# EAGLE design MicroMod-LoRa-1W-Function-Board (EAGLE 9.5.2)
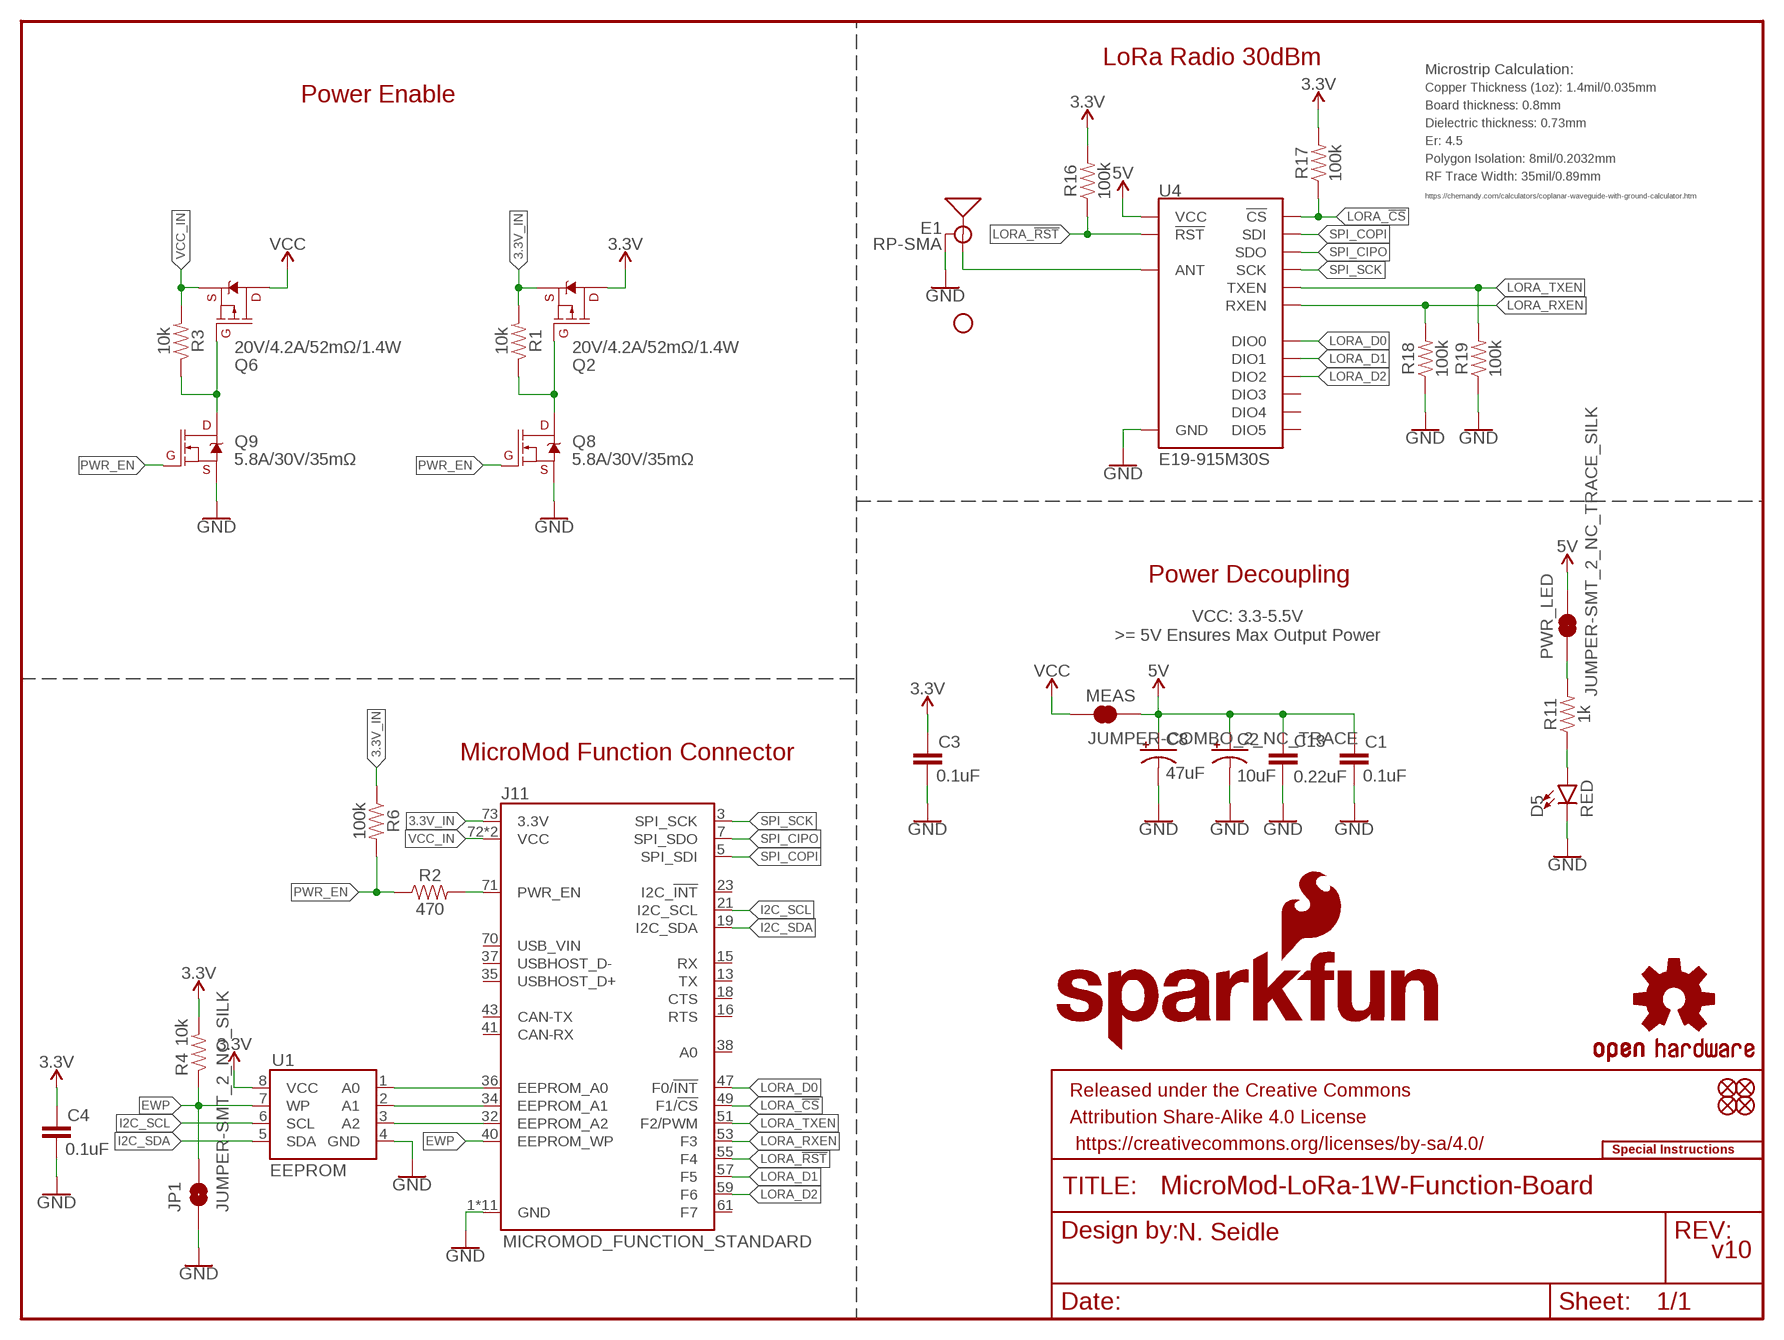
[diagram p0: schematic, sheet 1]

## Parts
C1  0.1uF  0.1UF-0603-25V-(+80/-20%)  [0603]
C2  10uF  10UF-POLAR-EIA3216-16V-10%(TANT)  [EIA3216]
C3  0.1uF  0.1UF-0603-25V-(+80/-20%)  [0603]
C4  0.1uF  0.1UF-0603-25V-(+80/-20%)  [0603]
C8  47uF  47UF-POLAR-EIA3528-10V-10%  [EIA3528]
C13  0.22uF  0.22UF-0603-25V-10%  [0603]
D5  RED  LED-RED0603  [LED-0603]
E1  RP-SMA  ANTENNA-SMA-GROUNDEDEDGE_RPSMA_SMD  [SMA-EDGE-SMD]
FD1  FIDUCIALUFIDUCIAL  [FIDUCIAL-MICRO]
FD2  FIDUCIALUFIDUCIAL  [FIDUCIAL-MICRO]
FD3  FIDUCIALUFIDUCIAL  [FIDUCIAL-MICRO]
FD4  FIDUCIALUFIDUCIAL  [FIDUCIAL-MICRO]
FRAME2  FRAME-LETTER  [CREATIVE_COMMONS]
H1  STAND-OFF  [STAND-OFF]
J11  MICROMOD_FUNCTION_STANDARD  [M.2-CARD-E-22_FUNCTION_STANDARD]
JP1  JUMPER-SMT_2_NO_SILK  [SMT-JUMPER_2_NO_SILK]
LOGO1  SFE_LOGO_NAME_FLAME.1_INCH  [SFE_LOGO_NAME_FLAME_.1]
LOGO2  SPECIAL_INSTRUCTIONS-ORDERING  [ORDERING_INSTRUCTIONS]
LOGO3  OSHW-LOGOMINI  [OSHW-LOGO-MINI]
MEAS  JUMPER-COMBO_2_NC_TRACE  [COMBO-JUMPER_2_NC_TRACE]
PWR_LED  JUMPER-SMT_2_NC_TRACE_SILK  [SMT-JUMPER_2_NC_TRACE_SILK]
Q2  20V/4.2A/52mΩ/1.4W  MOSFET_PCH-DMG2305UX-7  [SOT23-3]
Q6  20V/4.2A/52mΩ/1.4W  MOSFET_PCH-DMG2305UX-7  [SOT23-3]
Q8  5.8A/30V/35mΩ  MOSFET-NCH-AO3404A  [SOT23-3]
Q9  5.8A/30V/35mΩ  MOSFET-NCH-AO3404A  [SOT23-3]
R1  10k  10KOHM-0603-1/10W-1%  [0603]
R2  470  470OHM-0603-1/10W-1%  [0603]
R3  10k  10KOHM-0603-1/10W-1%  [0603]
R4  10k  10KOHM-0603-1/10W-1%  [0603]
R6  100k  100KOHM-0603-1/10W-1%  [0603]
R11  1k  1KOHM-0603-1/10W-1%  [0603]
R16  100k  100KOHM-0603-1/10W-1%  [0603]
R17  100k  100KOHM-0603-1/10W-1%  [0603]
R18  100k  100KOHM-0603-1/10W-1%  [0603]
R19  100k  100KOHM-0603-1/10W-1%  [0603]
U1  EEPROM  EEPROM-I2C512K  [SO08]
U4  E19-915M30S  E19-915MS1W  [E19-915MS1W]

## Nets
3.3V: C3.1 C4.1 Q2.3(D) R4.2 R16.2 R17.2 U1.8(VCC)
3.3V_IN: J11.73(3.3V) Q2.2(S) R1.2 R6.1
5V: C1.1 C2.+ C8.A(+) C13.1 MEAS.2 MEAS.4 PWR_LED.2 U4.11(VCC)
A0: J11.36(EEPROM_A0) U1.1(A0)
A1: J11.34(EEPROM_A1) U1.2(A1)
A2: J11.32(EEPROM_A2) U1.3(A2)
EWP: J11.40(EEPROM_WP) JP1.2 R4.1 U1.7(WP)
GND: C1.2 C2.- C3.2 C4.2 C8.C(-) C13.2 D5.C E1.GND@0(GND) E1.GND@1(GND) J11.1(GND) J11.33(GND) J11.39(GND) J11.45(GND) J11.75(GND) J11.GND1(GND) J11.GND2(GND) J11.GND3(GND) J11.GND4(GND) J11.GND5(GND) J11.GND6(GND) JP1.1 Q8.2(S) Q9.2(S) R18.1 R19.1 U1.4(GND) U4.1(GND) U4.9(GND) U4.10(GND) U4.18(GND) U4.20(GND) U4.21(GND) U4.22(GND)
I2C_SCL: J11.21(I2C_SCL) U1.6(SCL)
I2C_SDA: J11.19(I2C_SDA) U1.5(SDA)
LORA_!CS!: J11.49(F1/!CS!) R17.1 U4.15(!CS)
LORA_!RST!: J11.55(F4) R16.1 U4.8(!RST)
LORA_D0: J11.47(F0/!INT!) U4.7(DIO0)
LORA_D1: J11.57(F5) U4.6(DIO1)
LORA_D2: J11.59(F6) U4.5(DIO2)
LORA_RXEN: J11.53(F3) R18.2 U4.17(RXEN)
LORA_TXEN: J11.51(F2/PWM) R19.2 U4.16(TXEN)
N$1: E1.SIG(SIGNAL) U4.19(ANT)
N$2: Q2.1(G) Q8.3(D) R1.1
N$3: Q6.1(G) Q9.3(D) R3.1
N$4: J11.71(PWR_EN) R2.2
N$5: D5.A R11.1
N$6: PWR_LED.1 R11.2
PWR_EN: Q8.1(G) Q9.1(G) R2.1 R6.2
SPI_CIPO: J11.7(SPI_SDO) U4.13(SDO)
SPI_COPI: J11.5(SPI_SDI) U4.14(SDI)
SPI_SCK: J11.3(SPI_SCK) U4.12(SCK)
VCC: MEAS.1 MEAS.3 Q6.3(D)
VCC_IN: J11.72(VCC) J11.74(VCC) Q6.2(S) R3.2
Unconnected: J11.13(TX) J11.15(RX) J11.16(RTS) J11.18(CTS) J11.23(I2C_!INT!) J11.35(USBHOST_D+) J11.37(USBHOST_D-) J11.38(A0) J11.41(CAN-RX) J11.43(CAN-TX) J11.61(F7) J11.70(USB_VIN) U4.2(DIO5) U4.3(DIO4) U4.4(DIO3)

## Notes on the sheet
- LoRa Radio 30dBm
- Microstrip Calculation:
- Power Enable | Copper Thickness (1oz): 1.4mil/0.035mm
- Board thickness: 0.8mm
- Dielectric thickness: 0.73mm
- Er: 4.5
- Polygon Isolation: 8mil/0.2032mm
- RF Trace Width: 35mil/0.89mm
- https://chemandy.com/calculators/coplanar-waveguide-with-ground-calculator.htm
- Power Decoupling
- VCC: 3.3-5.5V
  >= 5V Ensures Max Output Power
- MicroMod Function Connector
- N. Seidle
- v10

## Library data of the parts
C1 C3 C4 = SparkFun-Capacitors:0.1UF: 0.1µF ceramic capacitors A capacitor is a passive two-terminal electrical component used to store electrical energy temporarily in an electric field.; PROD_ID: CAP-00810
C2 = SparkFun-Capacitors:10UF-POLAR: 10.0µF polarized capacitors A capacitor is a passive two-terminal electrical component used to store electrical energy temporarily in an electric field.; PROD_ID: CAP-00811
C8 = SparkFun-Capacitors:47UF-POLAR: 47µF polarized capacitors A capacitor is a passive two-terminal electrical component used to store electrical energy temporarily in an electric field.; PROD_ID: CAP-08310
C13 = SparkFun-Capacitors:0.22UF: 0.22µF ceramic capacitors A capacitor is a passive two-terminal electrical component used to store electrical energy temporarily in an electric field.; PROD_ID: CAP-07822
D5 = SparkFun-LED:LED-RED: Red SMD LED Used in manufacturing of most products at SparkFun Packages: 0603 - SMD 0603 package [Product Link] <http://docs.avagotech.com/docs/AV02-0551EN> 0603 SMART - SMD 0603 SMART package ( more efficient and expensive)[Product Link] <http://www.osram-os.com/Graphics/XPic2/00077099_0.pdf> 1206 - SMD1206 package [Product Link] <https://www.sparkfun.com/datasheets/DevTools/LilyPad/Q150OVS4.pdff> SparkFun Products: Pro Mini 328 -5V <https://www.sparkfun.com/products/821> RedBoard <https://www.sparkfun.com/products/12757> IOIO-OTG <https://www.sparkfun.com/products/13613>; PROD_ID: DIO-00819
E1 = SparkFun-RF:ANTENNA-SMA-GROUNDED: SMA Antenna Connector w/ Ground Edge-mount and SMD SMA connectors for RF Antennas. **4-LAYER BOARD WARNING!!** When designing a 4-layer board using any of the SMD variants, you will need to manually add a cutout polygon on any internal power layers to make sure that you don't end up with exposed copper around the edge of the routed hole for these connectors. Exposed power copper could then short to the connector body - and that would be bad. Why hasn't anyone added the cutout polygons directly to the connector footprint? Well, your internal layers (usually 2 and 15) may be covered with GND polygons and you might well want the copper to go all the way to the edge, especially under the connector SIGNAL pin. So adding cutouts to the footprint might make matters worse, not better...; PROD_ID: CONN-15101
FD1-FD4 = SparkFun-Aesthetics:FIDUCIAL: Fiducial Alignment Points Point-of-reference for pick-and-place machines and other optical instruments.
FRAME2 = SparkFun-Aesthetics:FRAME-LETTER: Schematic Frame - Letter Standard 8.5x11 US Letter frame
H1 = SparkFun-Hardware:STAND-OFF: Stand Off Drill holes for mechanically mounting via screws, standoffs, etc. Note: Use the keepout ring to avoid running the screw head into surrounding components. Variant Overviews STAND-OFF - Mechanical footprint for a #4 phillips button head screw. STAND-OFF-TIGHT - Mechanical footprint for a #4 phillips button head screw, Example SparkFun Products Screw - Phillips Head (1/4", 4-40, 10 pack) <https://www.sparkfun.com/products/10453> (PRT-10453) Screw - Phillips Head (1/2", 4-40, 10 pack) <https://www.sparkfun.com/products/10452> (PRT-10452) Screw - Phillips Head (3/4", 4-40, 10 pack) <https://www.sparkfun.com/products/10451> (PRT-10451) Screw - Phillips Head (1", 4-40, 10 pack) <https://www.sparkfun.com/products/10450> (PRT-10450)
J11 = SparkFun-MicroMod:MICROMOD_FUNCTION: MicroMod Connector Description: A card edge connector and mating PCB connector to allow various MicroMod Processor Boards to be coupled with various carrier boards of different capabilities. Based on the M.2 standard.
JP1 = SparkFun-Jumpers:JUMPER-SMT_2_NO: Normally open jumper This jumper has two pads in close proximity to each other. Apply solder to close the connection. Round pads are easier to solder for beginners, but are a lot larger. SparkFun Product that uses the round pads: SparkFun EL Sequencer <https://www.sparkfun.com/products/12781>
LOGO1 = SparkFun-Aesthetics:SFE_LOGO_NAME_FLAME: SparkFun Font Logo w/ Flame This is the SparkFun full logo. The logo on the schematic will always be the same size; the package variant is the height of the flame part of the logo. Default layer for the logo on the board is tSilk.
LOGO2 = SparkFun-Aesthetics:SPECIAL_INSTRUCTIONS: Special Ordering/Production Instructions Alert Symbol for special PCB ordering instructions or unique production process warnings. Ordering Instructions Production Instructions Types of information that should be added to box: Copper weight Soldermask color Silk color PCB thickness Number of layers PCB Standard: 1.6mm FR4 1 oz copper immersion silver plating red soldermask white silkscreen Types of information that should be added to box: Special wash requirements Depaneling instructions Humidification Glue curing Default text settings: 0.07 inch 9% ratio 50% line distance
LOGO3 = SparkFun-Aesthetics:OSHW-LOGO: Open-Source Hardware (OSHW) Logo This logo indicates the piece of hardware it is found on incorporates a OSHW license and/or adheres to the definition of open source hardware found here: http://freedomdefined.org/OSHW
MEAS = SparkFun-Jumpers:JUMPER-COMBO_2_NC_TRACE
PWR_LED = SparkFun-Jumpers:JUMPER-SMT_2_NC_TRACE: Normally closed trace jumper This jumper has a trace between two pads so it's normally closed (NC). Use a razor knife to open the connection. For best results follow the IPC guidelines for cutting traces: Cutout at least 0.063 mm (0.005 in). Remove all loose material to clean up the cut area. Seal the cut with an approved epoxy. Reapply solder to reclose the connection.
Q2 Q6 = SparkFun-DiscreteSemi:MOSFET_PCH: P-channel MOSFETs Voltage controlled devices that allow control of high current outputs. SparkFun Products: SparkFun ESP32 Thing <https://www.sparkfun.com/products/13907> SparkFun ESP8266 Thing <https://www.sparkfun.com/products/13231> SparkFun Pi Servo HAT V2 <https://www.sparkfun.com/products/15316> DMG2305UX-7 (20V/4.2A/SOT23-3); PROD_ID: TRANS-14388
Q8 Q9 = SparkFun-DiscreteSemi:MOSFET-NCH: N-channel MOSFETs Voltage controlled devices that allow control of high current outputs. SparkFun Products: SparkFun OpenScale <https://www.sparkfun.com/products/13261> SparkFun Digital Sandbox <https://www.sparkfun.com/products/12651> SparkFun Monster Moto Shield <https://www.sparkfun.com/products/10182> SparkFun MOSFET Power Controller <https://www.sparkfun.com/products/11214>; PROD_ID: TRANS-12988
R1 R3 R4 = SparkFun-Resistors:10KOHM: 10kΩ resistor A resistor is a passive two-terminal electrical component that implements electrical resistance as a circuit element. Resistors act to reduce current flow, and, at the same time, act to lower voltage levels within circuits. - Wikipedia; PROD_ID: RES-00824
R2 = SparkFun-Resistors:470OHM: 470Ω resistor A resistor is a passive two-terminal electrical component that implements electrical resistance as a circuit element. Resistors act to reduce current flow, and, at the same time, act to lower voltage levels within circuits. - Wikipedia; PROD_ID: RES-07869
R6 R16-R19 = SparkFun-Resistors:100KOHM: 100kΩ resistor A resistor is a passive two-terminal electrical component that implements electrical resistance as a circuit element. Resistors act to reduce current flow, and, at the same time, act to lower voltage levels within circuits. - Wikipedia; PROD_ID: RES-07828
R11 = SparkFun-Resistors:1KOHM: 1kΩ resistor A resistor is a passive two-terminal electrical component that implements electrical resistance as a circuit element. Resistors act to reduce current flow, and, at the same time, act to lower voltage levels within circuits. - Wikipedia; PROD_ID: RES-07856
U1 = SparkFun-IC-Memory:EEPROM-I2C: I2C EEPROMs, 24LC256 and others 24LC256 Series 256 kb I2C 2 Wire (32 k x 8 Bit) 2.5 V Serial EEPROM SMD - SOIC-8 Datasheet SparkFun Products SparkFun UDB5 - PIC UAV Development Board <https://www.sparkfun.com/products/11703> (GPS-11703); PROD_ID: IC-14645
U4 = SparkFun-RF:E19-915MS1W: Chengdu Ebyte E19-915M30S - 915M LoRa (FSK) TRX Using SX1276 This is a 915 MHz LoRa (or optionally FSK) modulated transciver bassed on the Semtech SX1276. It has a high ouput power of 1W an a pre-installed U.FL connector. Can be used with LoRa WAN with DIO0, DIO1, and DIO2 hooked up to controller interrupt inputs SparkFun Products: SAMD21 Pro RF 1W <https://www.sparkfun.com/products/15034>; PROD_ID: IC-14076

## Net classes
0 default: width 0 mm, drill 0 mm
1 vcc: width 0 mm

## Board
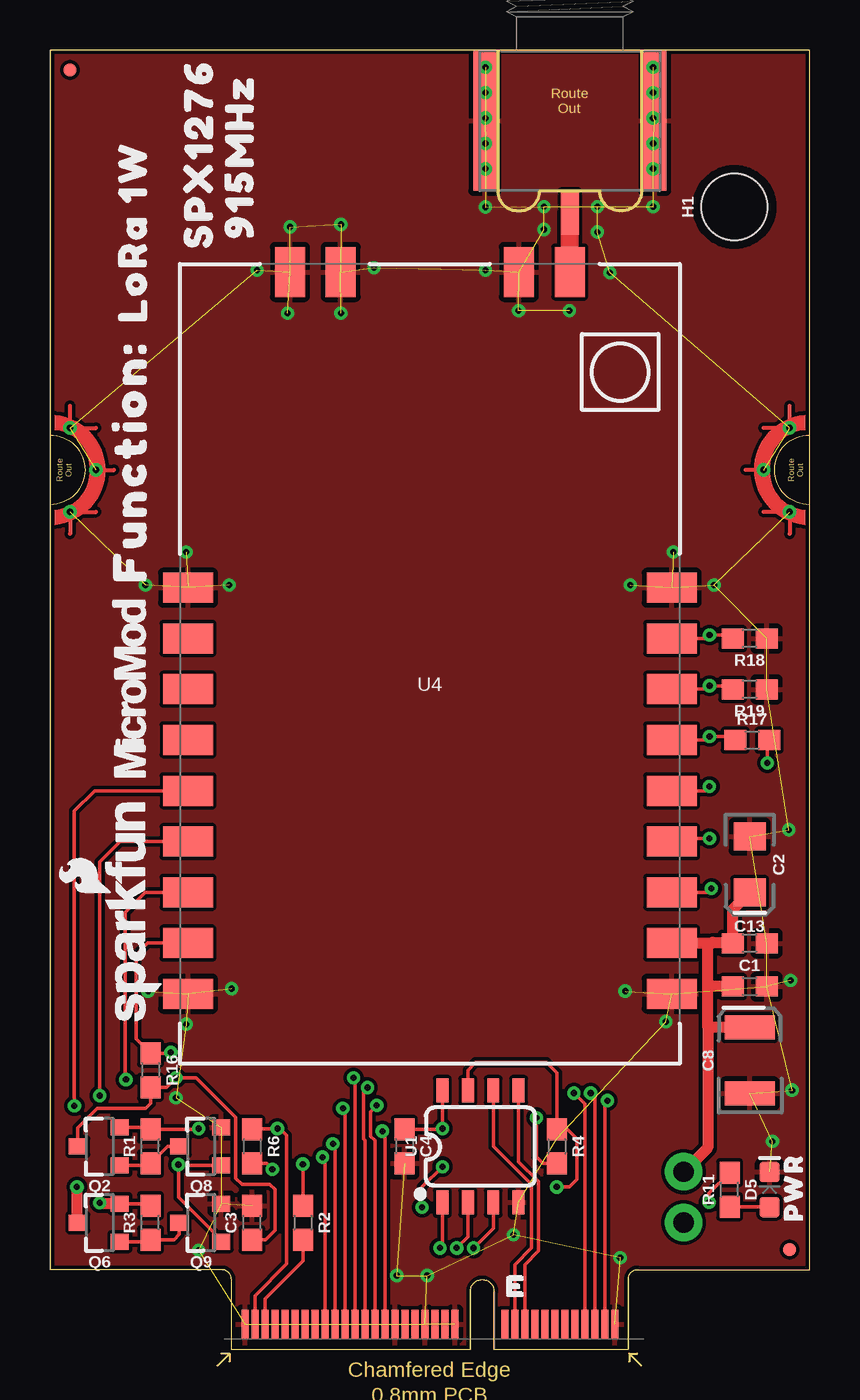
[diagram p1: board, top side]
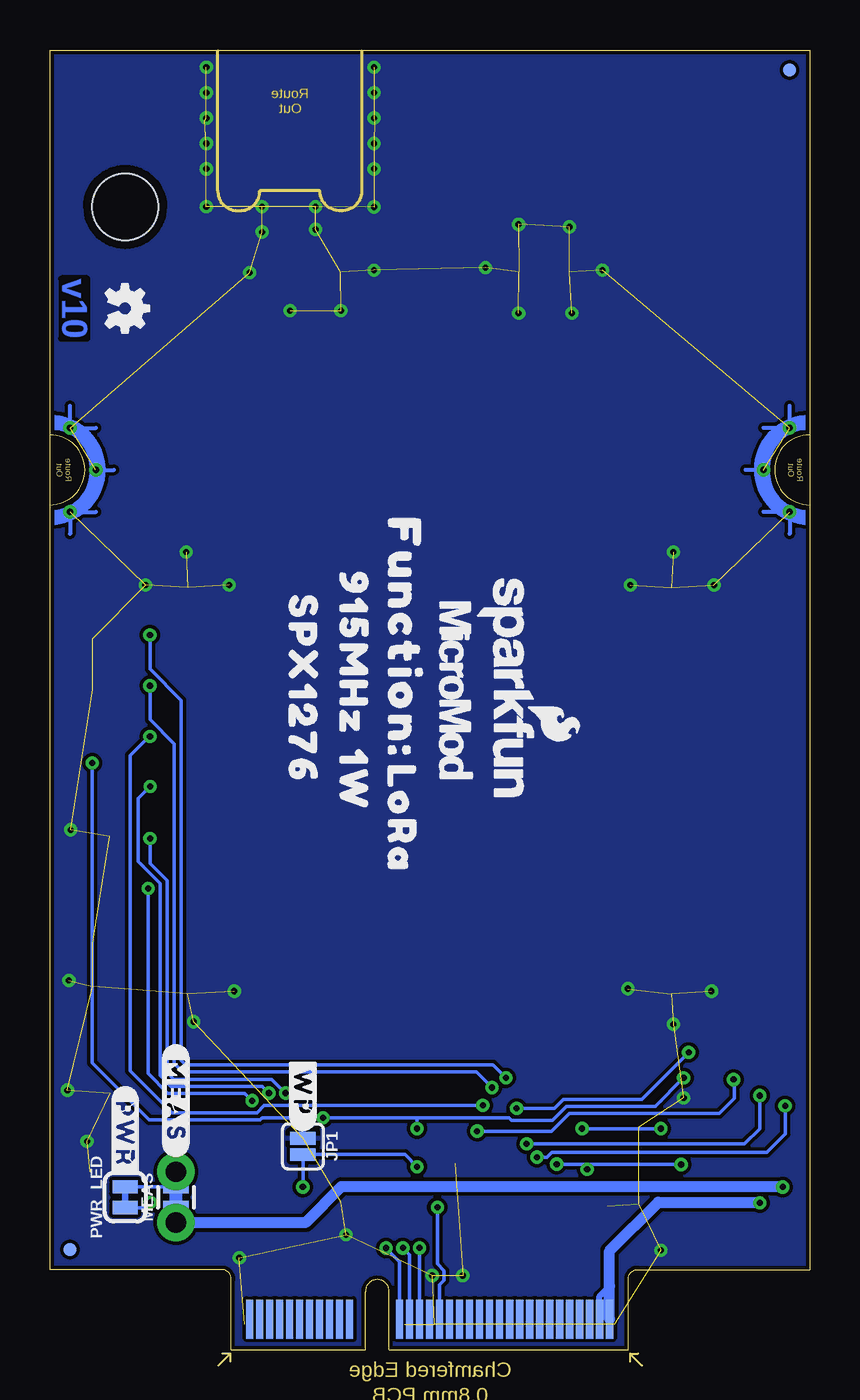
[diagram p2: board, bottom side, seen from below]

Size 38 x 65 mm. Coordinates in mm from the lower left corner, seen from the top.
Outline: 28.93,0 22.22,0 22.22,2.9 arc180 21.02,2.9 21.02,0 9.07,0 9.07,3.5 arc90 8.6,4 0,4 0,65 38,65 38,4 29.4,4 arc90 28.93,3.5 28.93,0
Copper layers (1*16): Top/Horz 0.035mm / dielectric 1.5mm / Bottom/Vert 0.035mm
Design rules "SparkFun-2-layer-TIGHT *": minimum track width 7mil, minimum drill 12mil, track to track 7mil, track to pad 7mil, pad to pad 7mil, via to via 7mil, smd to smd 7mil, copper to edge 7mil, drill to drill 7mil, minimum pad ring 7mil, minimum via ring 7mil, stop-mask expansion 4mil, vias tented up to drill 25mil, thermal gap 10mil

### Footprints (pad centres in the part's own frame; a part is rotated, then mirrored left to right if it is on the bottom)
0603 = smd 1.1 x 1: 1 -0.85,0; 2 0.85,0
EIA3216 = smd 1.4 x 1.6: + 1.4,0; - -1.4,0
EIA3528 = smd 1.2 x 2.5: A 1.65,0; C -1.65,0
LED-0603 = smd 1 x 1: A -0.877,0; C 0.877,0
SMA-EDGE-SMD = smd 1.15 x 7: GND@0 -4.25,-3.5; GND@1 4.25,-3.5 | smd 0.9 x 2.2: SIG 0,-8.1
FIDUCIAL-MICRO = smd 0.635 x 0.635: 1 0,0
STAND-OFF = hole 3.302: 0,0
M.2-CARD-E-22_FUNCTION_STANDARD = smd 0.35 x 1.45: 1 9.25,1.275; 3 8.75,1.275; 5 8.25,1.275; 7 7.75,1.275; 9 7.25,1.275; 11 6.75,1.275; 13 6.25,1.275; 15 5.75,1.275; 17 5.25,1.275; 19 4.75,1.275; 21 4.25,1.275; 23 3.75,1.275; 33 1.25,1.275; 35 0.75,1.275; 37 0.25,1.275; 39 -0.25,1.275; 41 -0.75,1.275; 43 -1.25,1.275; 45 -1.75,1.275; 47 -2.25,1.275; 49 -2.75,1.275; 51 -3.25,1.275; 53 -3.75,1.275; 55 -4.25,1.275; 57 -4.75,1.275; 59 -5.25,1.275; 61 -5.75,1.275; 63 -6.25,1.275; 65 -6.75,1.275; 67 -7.25,1.275; 69 -7.75,1.275; 71 -8.25,1.275; 73 -8.75,1.275; 75 -9.25,1.275 | smd 0.35 x 1.95 bottom: 2 9,1.525; 4 8.5,1.525; 6 8,1.525; 8 7.5,1.525; 10 7,1.525; 12 6.5,1.525; 14 6,1.525; 16 5.5,1.525; 18 5,1.525; 20 4.5,1.525; 22 4,1.525; 32 1.5,1.525; 34 1,1.525; 36 0.5,1.525; 38 0,1.525; 40 -0.5,1.525; 42 -1,1.525; 44 -1.5,1.525; 46 -2,1.525; 48 -2.5,1.525; 50 -3,1.525; 52 -3.5,1.525; 54 -4,1.525; 56 -4.5,1.525; 58 -5,1.525; 60 -5.5,1.525; 62 -6,1.525; 64 -6.5,1.525; 66 -7,1.525; 68 -7.5,1.525; 70 -8,1.525; 72 -8.5,1.525; 74 -9,1.525 | drill 0.305 pad 0.61: GND1 -18,41.9; GND2 -16.7,44; GND3 -18,46.1; GND4 18,41.9; GND5 16.7,44; GND6 18,46.1
SMT-JUMPER_2_NO_SILK = smd 0.635 x 1.27: 1 -0.406,0; 2 0.406,0
COMBO-JUMPER_2_NC_TRACE = smd 0.635 x 1.27: 1 -0.508,0; 2 0.508,0 | drill 1.016 pad 1.88: 3 -1.27,0; 4 1.27,0
SMT-JUMPER_2_NC_TRACE_SILK = smd 0.66 x 1.27: 1 -0.521,0; 2 0.521,0
SOT23-3 = smd 0.8 x 0.9: 1 -0.95,-1; 2 0.95,-1; 3 0,1.1
SO08 = smd 0.6 x 1.2: 1 -1.905,-2.8; 2 -0.635,-2.8; 3 0.635,-2.8; 4 1.905,-2.8; 5 1.905,2.8; 6 0.635,2.8; 7 -0.635,2.8; 8 -1.905,2.8
E19-915MS1W = smd 2.5 x 1.5: 1 12.1,-3.82; 2 12.1,-1.28; 3 12.1,1.26; 4 12.1,3.8; 5 12.1,6.34; 6 12.1,8.88; 7 12.1,11.42; 8 12.1,13.96; 9 12.1,16.5; 10 -12.1,16.5; 11 -12.1,13.96; 12 -12.1,11.42; 13 -12.1,8.88; 14 -12.1,6.34; 15 -12.1,3.8; 16 -12.1,1.26; 17 -12.1,-1.28; 18 -12.1,-3.82 | smd 1.5 x 2.5: 19 -7,-19.6; 20 -4.46,-19.6; 21 4.46,-19.6; 22 7,-19.6

### Placement (x,y rotation side)
C1  35,18.16 0 top
C2  35,24.26 270 top
C3  10.11,6.35 90 top
C4  17.73,10.16 270 top
C8  35,14.46 90 top
C13  35,20.32 0 top
D5  36,8 90 top
E1  26,64.96 0 top
FD1  37,5 90 top
FD2  1,64 90 top
FD3  37,5 270 bottom
FD4  1,64 270 bottom
FRAME2  7.57,-27.94 0 top  (outside the outline)
H1  34.24,57.15 90 top
J11  19,0 0 top
JP1  25.35,10.16 270 bottom
LOGO1  4.14,21.97 90 top
LOGO2  45.67,60.96 0 top  (outside the outline)
LOGO3  34.24,52.07 270 bottom
LOGO4  SFE_LOGO_NAME_FLAME.1_INCH  [SFE_LOGO_NAME_FLAME_.1]  15.19,33.02 270 bottom
MEAS  31.7,7.62 90 bottom
PWR_LED  34.24,7.62 90 bottom
Q2  2.49,10.16 90 top
Q6  2.49,6.35 90 top
Q8  7.57,10.16 90 top
Q9  7.57,6.35 90 top
R1  5.03,10.16 90 top
R2  12.65,6.35 270 top
R3  5.03,6.35 90 top
R4  25.35,10.16 270 top
R6  10.11,10.16 270 top
R11  34,8 90 top
R16  5.03,13.97 270 top
R17  35.13,30.48 0 top
R18  35,35.56 180 top
R19  35,33.02 180 top
U1  21.54,10.16 0 top
U4  19,34.29 180 top
U$1  [LORA0]  20.4,26.54 270 bottom
U$2  [1W1]  4.14,58.93 90 top
U$3  [915MHZ2]  9.47,59.69 90 top
U$4  [FUNCTION#0]  20.27,35.56 270 bottom
U$5  [LORA0]  4.14,54.1 90 top
U$6  [SPX12763]  7.44,59.82 90 top
U$7  [PWR0]  37.2,8.1 90 top
U$8  [FUNCTION#0]  4.01,44.45 90 top
U$9  [#PWR#0]  34.24,10.79 270 bottom
U$10  [#WP#0]  25.35,12.83 270 bottom
U$27  [SPX12763]  25.35,33.02 270 bottom
U$28  [#MEAS#3]  31.7,15.24 270 bottom
U$29  [915MHZ2]  22.81,34.8 270 bottom
U$30  [1W1]  22.81,28.45 270 bottom
U$37  [MICROMOD_LOGO_.35]  17.73,33.02 270 bottom
U$63  [MICROMOD_LOGO_.35]  4,33 90 top

### Tracks (layer width: path | path; a pad name or v marks a point on that pad's centre or on a via)
3.3V  (via drill 0.3)
  Top/Horz 0.178: U1.8 v19.63,11.05 19.6,11.01 C4.1 | v35.89,29.34 35.89,30.39 R17.2 | R4.2 24.67,9.31 24.34,9.64 v24.34,11.59 | Q2.3 1.39,11.09 2.36,12.06 4.78,12.06 5.03,12.32 R16.2 5.83,13.12 v6.3,13.59 7.32,13.59 9.29,11.62 9.29,8.57 9.6,8.26 11,8.26 11.25,8 11.25,5.97 10.78,5.5 C3.1
  Bottom/Vert 0.178: v35.89,29.34 35.89,14.34 33.05,11.49 27.5,11.49 27.39,11.59 v24.34,11.59 19.63,11.59 | 19.63,11.59 15.03,11.59 14.9,11.47 12.86,11.47 12.16,12.17 7.72,12.17 v6.3,13.59 | v19.63,11.05 19.63,11.59
3.3V_IN  (via drill 0.3)
  Top/Horz 0.178: J11.73 10.25,2.68 11.85,4.28 11.85,10.71 11.51,11.05 v11.38,11.05 10.15,11.05 R6.1 | v7.44,11.05 7.4,11.01 5.16,11.01 | 5.16,11.01 R1.2 | Q2.2 5.06,11.11 5.16,11.01
  Bottom/Vert 0.178: v7.44,11.05 v11.38,11.05
5V
  Top/Horz 0.559: U4.11 32.9,20.33 | 32.9,20.33 33.15,20.33 33.15,20.37 34.1,20.37 C13.1 34.15,22.01 C2.+ | 32.9,16.16 32.9,10.09 MEAS.4 | 32.9,16.16 32.9,18.36 | 32.9,18.36 32.9,20.33 | C1.1 33.1,18.16 32.9,18.36 | C8.A 32.95,16.11 32.9,16.16
  Bottom/Vert 0.178: PWR_LED.2 34.23,8.13 MEAS.2 MEAS.4
A0  (via drill 0.3)
  Top/Horz 0.178: v19.51,5.08 19.63,5.21 U1.1
  Bottom/Vert 0.178: J11.36 v19.5,5.07 v19.51,5.08
A1  (via drill 0.3)
  Top/Horz 0.178: U1.2 20.9,5.64 v20.35,5.08
  Bottom/Vert 0.178: v20.35,5.08 20.11,4.84 20.11,4.83 20,4.73 J11.34
A2  (via drill 0.3)
  Top/Horz 0.178: U1.3 22.18,6.07 v21.18,5.07
  Bottom/Vert 0.178: v21.18,5.07 20.5,4.39 J11.32
EWP  (via drill 0.3)
  Top/Horz 0.178: U1.7 20.9,13.97 21.29,14.35 24.84,14.35 25.35,13.84 R4.1 25.9,11.01 26.37,10.54 26.37,8.51 25.98,8.13 v25.35,8.13 | v18.62,7.11 18.62,8.13 v19.63,9.14
  Bottom/Vert 0.178: v25.35,8.13 JP1.2 20.25,9.75 v19.63,9.14 | J11.40 18.5,3.23 18.28,3.45 18.28,3.95 18.62,4.29 v18.62,7.11
GND  (via drill 0.3)  (77 unrouted)
  Top/Horz 0.254: J11.GND4 35.7,43.2 J11.GND5 | J11.GND1 2.3,43.2 J11.GND2
  other vias: 6.81,16.27 9.09,18.05 4.9,17.92 4.78,38.24 6.81,39.89 8.97,38.24 11.89,51.83 10.36,53.99 12.01,56.15 14.55,56.28 16.21,54.12 14.55,51.83 21.79,57.15 21.79,53.99 23.45,51.96 28.02,53.86 33.22,38.24 31.19,39.89 29.03,38.24 28.78,17.92 30.81,16.4 37.13,12.97 37.05,18.47 36.96,26 36.15,10.41 21.79,59.05 21.79,60.33 21.79,61.59 21.79,62.87 21.79,64.14 30.18,64.14 30.18,62.87 30.18,61.59 30.18,60.33 30.18,59.05 28.52,4.59 23.19,5.73 18.87,3.7 17.35,3.7 7.44,4.97 27.38,55.9 27.38,57.17 24.71,57.17 24.71,56.02 30.18,57.17 25.98,51.96 6.3,12.59
  pour Bottom/Vert (isolate 0.152): 0,0 0,65 38,65 38,0
  pour Top/Horz (isolate 0.152): 0,0 0,65 38,65 38,0
I2C_SCL
  Top/Horz 0.178: J11.21 23.25,4.25 24.08,5.08 24.08,8.26 22.18,10.16 U1.6
I2C_SDA
  Top/Horz 0.178: J11.19 23.75,4.25 24.44,4.93 24.44,8.41 23.45,9.4 U1.5
LORA_!CS!  (via drill 0.3)
  Top/Horz 0.178: R17.1 34.1,30.66 v33,30.66 32.83,30.49 U4.15 | J11.49 16.25,10.46 16.03,10.68 16.03,11.9 v16.35,12.21
  Bottom/Vert 0.178: v33,30.66 33.04,30.66 33.99,29.71 33.99,13.94 31.9,11.85 27.64,11.85 27.28,12.21 v16.35,12.21
LORA_!RST!  (via drill 0.3)
  Top/Horz 0.178: U4.8 4.9,20.33 4.31,19.74 4.31,15.54 R16.1 6.01,14.82 v6.05,14.86 | J11.55 14.75,11.97 v14.65,12.06
  Bottom/Vert 0.178: v14.65,12.06 12.77,12.06 12.31,12.52 8.38,12.52 v6.05,14.86
LORA_D0  (via drill 0.3)
  Top/Horz 0.178: U4.7 4.77,22.87 3.76,21.86 3.76,13.54 v3.8,13.5 | J11.47 16.75,10.8 v16.63,10.92
  Bottom/Vert 0.178: v16.63,10.92 12.9,10.92 12.01,11.81 4.52,11.81 3.76,12.57 3.76,13.46 v3.8,13.5
LORA_D1  (via drill 0.3)
  Top/Horz 0.178: v2.49,12.7 2.49,24.4 3.5,25.41 U4.6 | J11.57 14.25,10.19 v14.15,10.29
  Bottom/Vert 0.178: v2.49,12.7 2.49,11.05 3.25,10.29 v14.15,10.29
LORA_D2  (via drill 0.3)
  Top/Horz 0.178: v1.22,12.19 1.22,26.94 2.23,27.95 U4.5 | J11.59 13.75,9.51 v13.63,9.62
  Bottom/Vert 0.178: v13.63,9.62 13.14,9.62 12.9,9.87 2.15,9.87 1.22,10.79 v1.22,12.19
LORA_RXEN  (via drill 0.3)
  Top/Horz 0.178: J11.53 15.25,13.53 v15.19,13.59 | U4.17 32.83,35.57 v33,35.74 33.97,35.74 R18.2
  Bottom/Vert 0.178: v33,35.74 33,34.04 31.43,32.47 31.43,14.46 31.21,14.23 15.83,14.23 v15.19,13.59
LORA_TXEN  (via drill 0.3)
  Top/Horz 0.178: R19.2 33.97,33.2 v33,33.2 32.83,33.03 U4.16 | J11.51 15.75,10.46 15.68,10.53 15.68,12.89 v15.89,13.1
  Bottom/Vert 0.178: v33,33.2 33,31.5 31.78,30.29 31.78,14.31 31.35,13.88 16.66,13.88 v15.89,13.1
N$1
  Top/Horz 0.889: U4.19 E1.SIG
N$2
  Top/Horz 0.178: Q2.1 4.93,9.21 R1.1 5.88,10.16 Q8.3
N$3
  Top/Horz 0.178: Q6.1 4.93,5.4 R3.1 6.21,5.5 6.47,5.76 Q9.3
N$4
  Top/Horz 0.178: J11.71 10.75,2.54 12.65,4.45 R2.2
N$5
  Top/Horz 0.178: R11.1 35.97,7.15 D5.A
N$6  (via drill 0.3)
  Top/Horz 0.178: R11.2 32.97,7.82 v32.97,7.37
  Bottom/Vert 0.178: v32.97,7.37 33.24,7.1 PWR_LED.1
PWR_EN  (via drill 0.3)
  Top/Horz 0.178: v12.65,9.27 R2.1 | R6.2 10.83,9.31 v11.13,9.02 | Q9.1 8.57,5.48 6.43,7.62 v6.43,9.25 6.47,9.21 Q8.1
  Bottom/Vert 0.178: v12.65,9.27 12.63,9.25 11.13,9.25 | 11.13,9.25 v6.43,9.25 | v11.13,9.02 11.13,9.25
SPI_CIPO  (via drill 0.3)
  Top/Horz 0.178: v33,25.56 31.25,25.56 U4.13 | J11.7 26.75,12.29 26.45,12.58 26.45,12.59 v26.21,12.83
  Bottom/Vert 0.178: v33,25.56 33,24.31 32.14,23.45 32.14,13.85 31.81,13.52 26.9,13.52 26.45,13.07 v26.21,12.83
SPI_COPI  (via drill 0.3)
  Top/Horz 0.178: v32.99,28.16 32.78,27.95 U4.14 | J11.5 27.25,12.63 v27.05,12.83
  Bottom/Vert 0.178: v32.99,28.16 33.59,27.56 33.59,24.4 32.5,23.31 32.5,13.71 31.96,13.17 27.38,13.17 27.29,13.07 v27.05,12.83
SPI_SCK  (via drill 0.3)
  Top/Horz 0.178: v33.09,23.06 32.9,22.87 U4.12 | J11.3 27.75,12.31 v27.89,12.45
  Bottom/Vert 0.178: v33.09,23.06 33.09,13.8 32.1,12.81 28.25,12.81 v27.89,12.45
VCC  (via drill 0.3)
  Top/Horz 0.559: v1.35,8.13 1.35,6.39 Q6.3
  Bottom/Vert 0.178: MEAS.1 MEAS.3
  Bottom/Vert 0.559: v1.35,8.13 1.37,8.15 23.42,8.15 25.22,6.35 MEAS.3
VCC_IN  (via drill 0.3)
  Top/Horz 0.178: R3.2 4.93,7.3 Q6.2
  Top/Horz 0.559: Q6.2 2.53,7.3 v2.49,7.34
  Bottom/Vert 0.305: J11.72 10.5,2.67 10,3.17
  Bottom/Vert 0.559: v2.49,7.34 2.52,7.37 7.57,7.37 10,4.94 10,3.17 J11.74

### Text on the board
Bottom/Vert: v10
tDocu: Board Thickness is 0.8mm | 2-Layer | Beveled Edge | ENIG Finish | N. Seidle